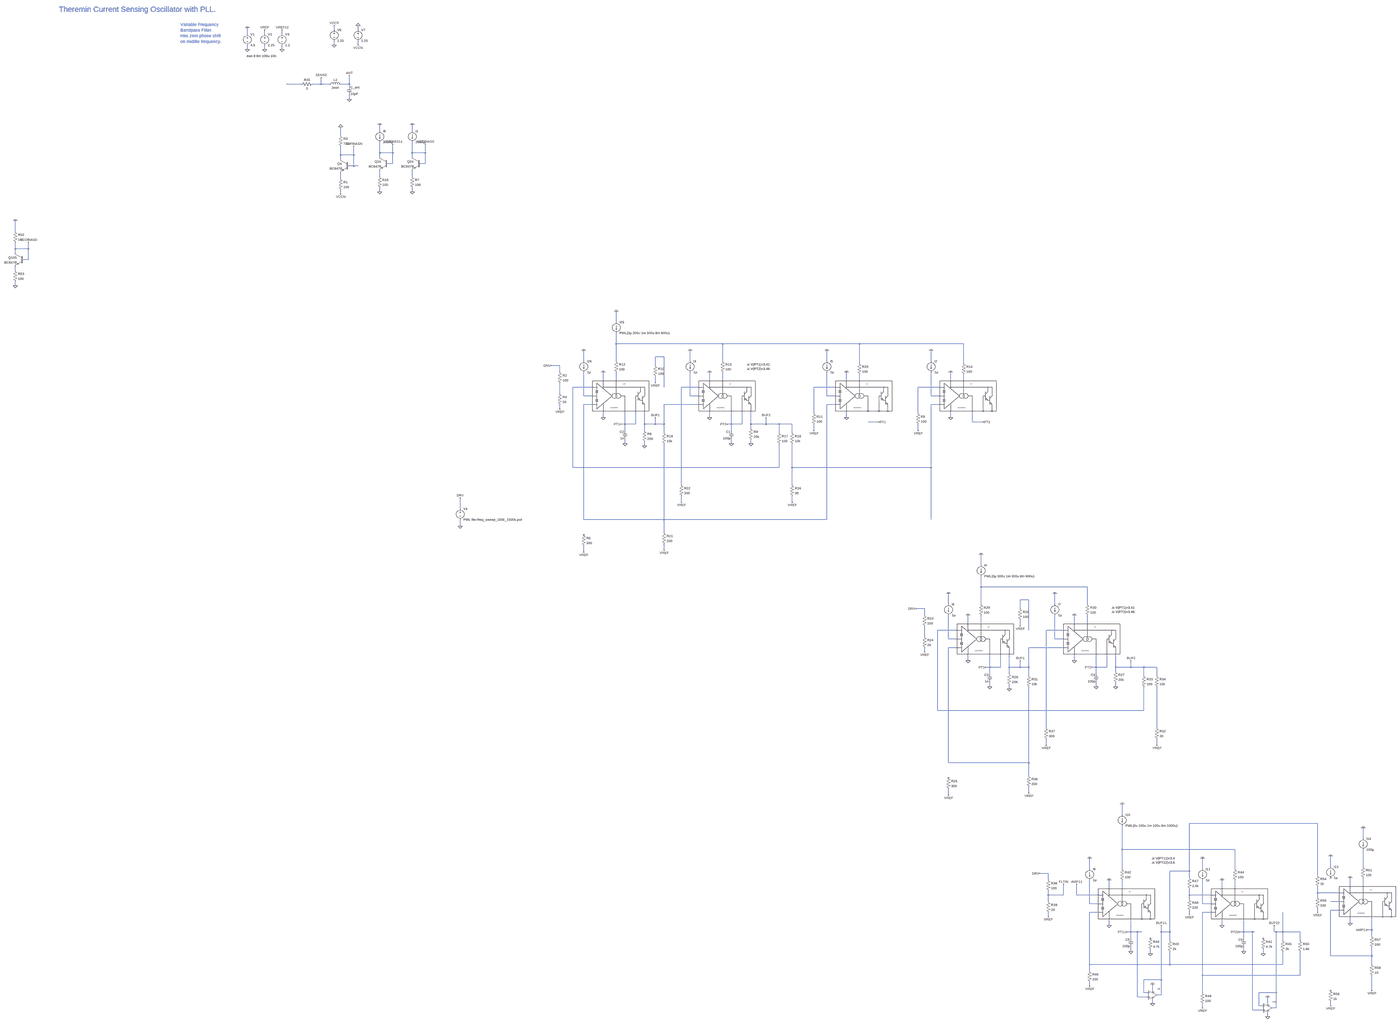
[diagram p0: schematic vco_and_lc_drive_v13.asc, whole sheet]
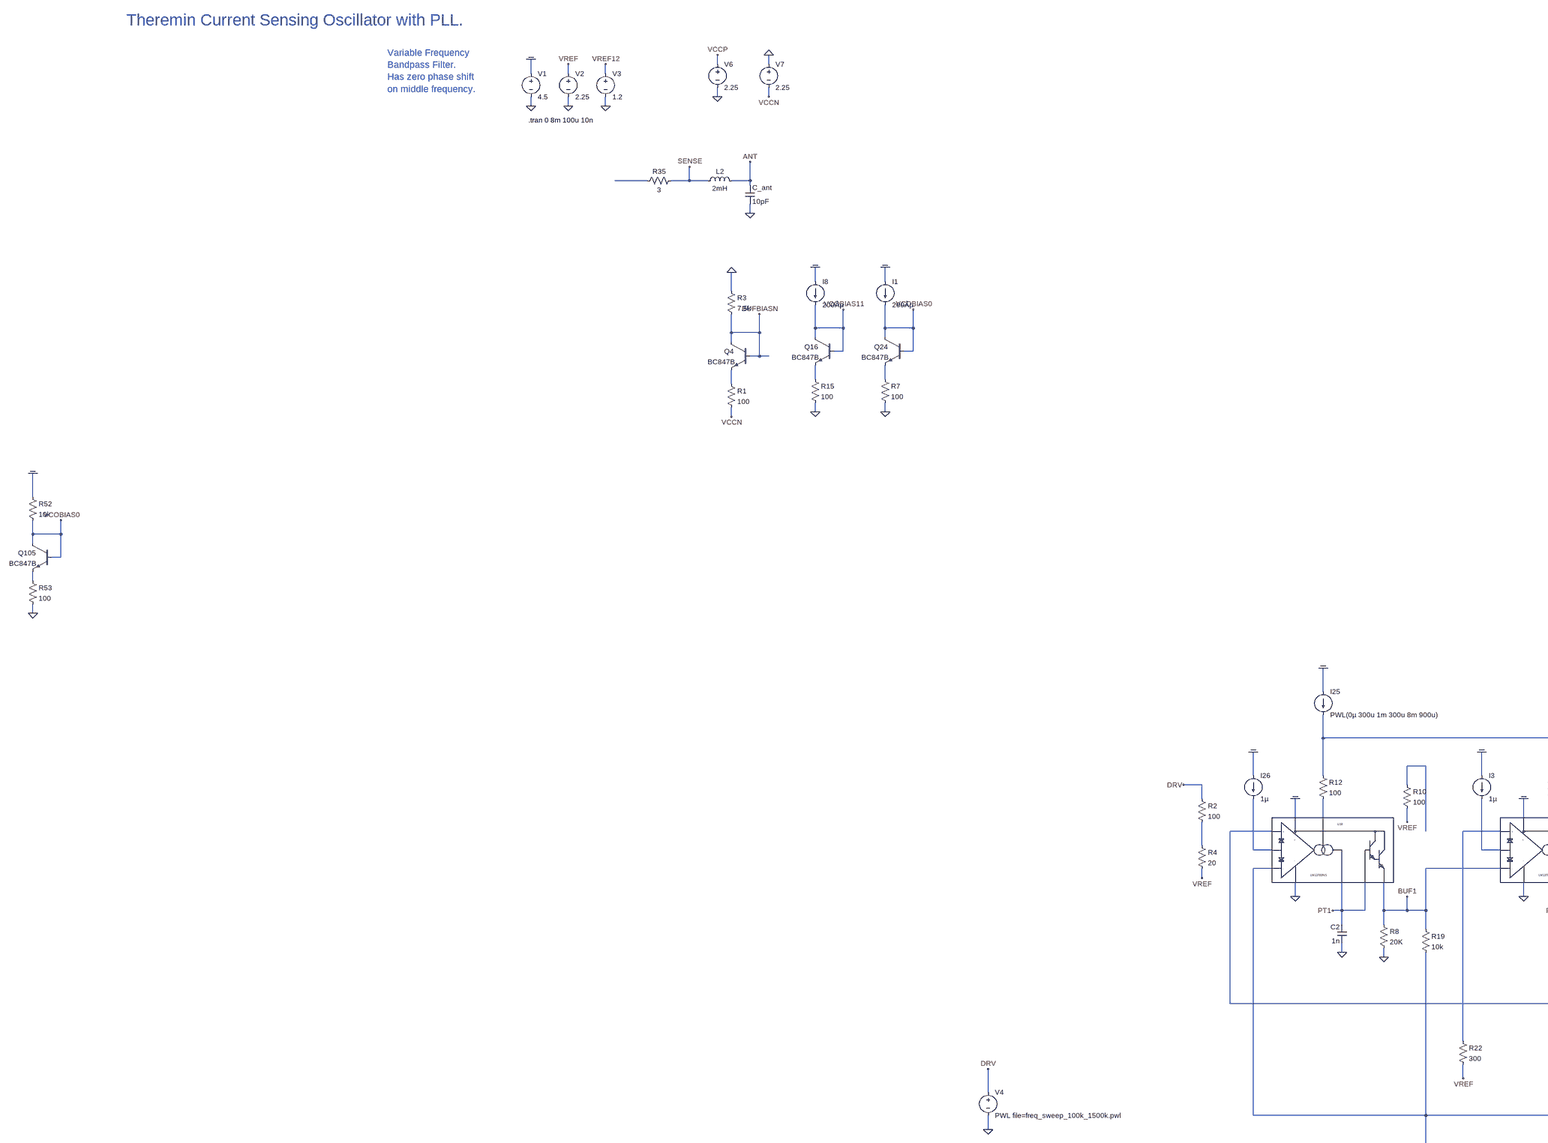
[diagram p1: schematic vco_and_lc_drive_v13.asc, part, row 1 of 2, column 1 of 2]
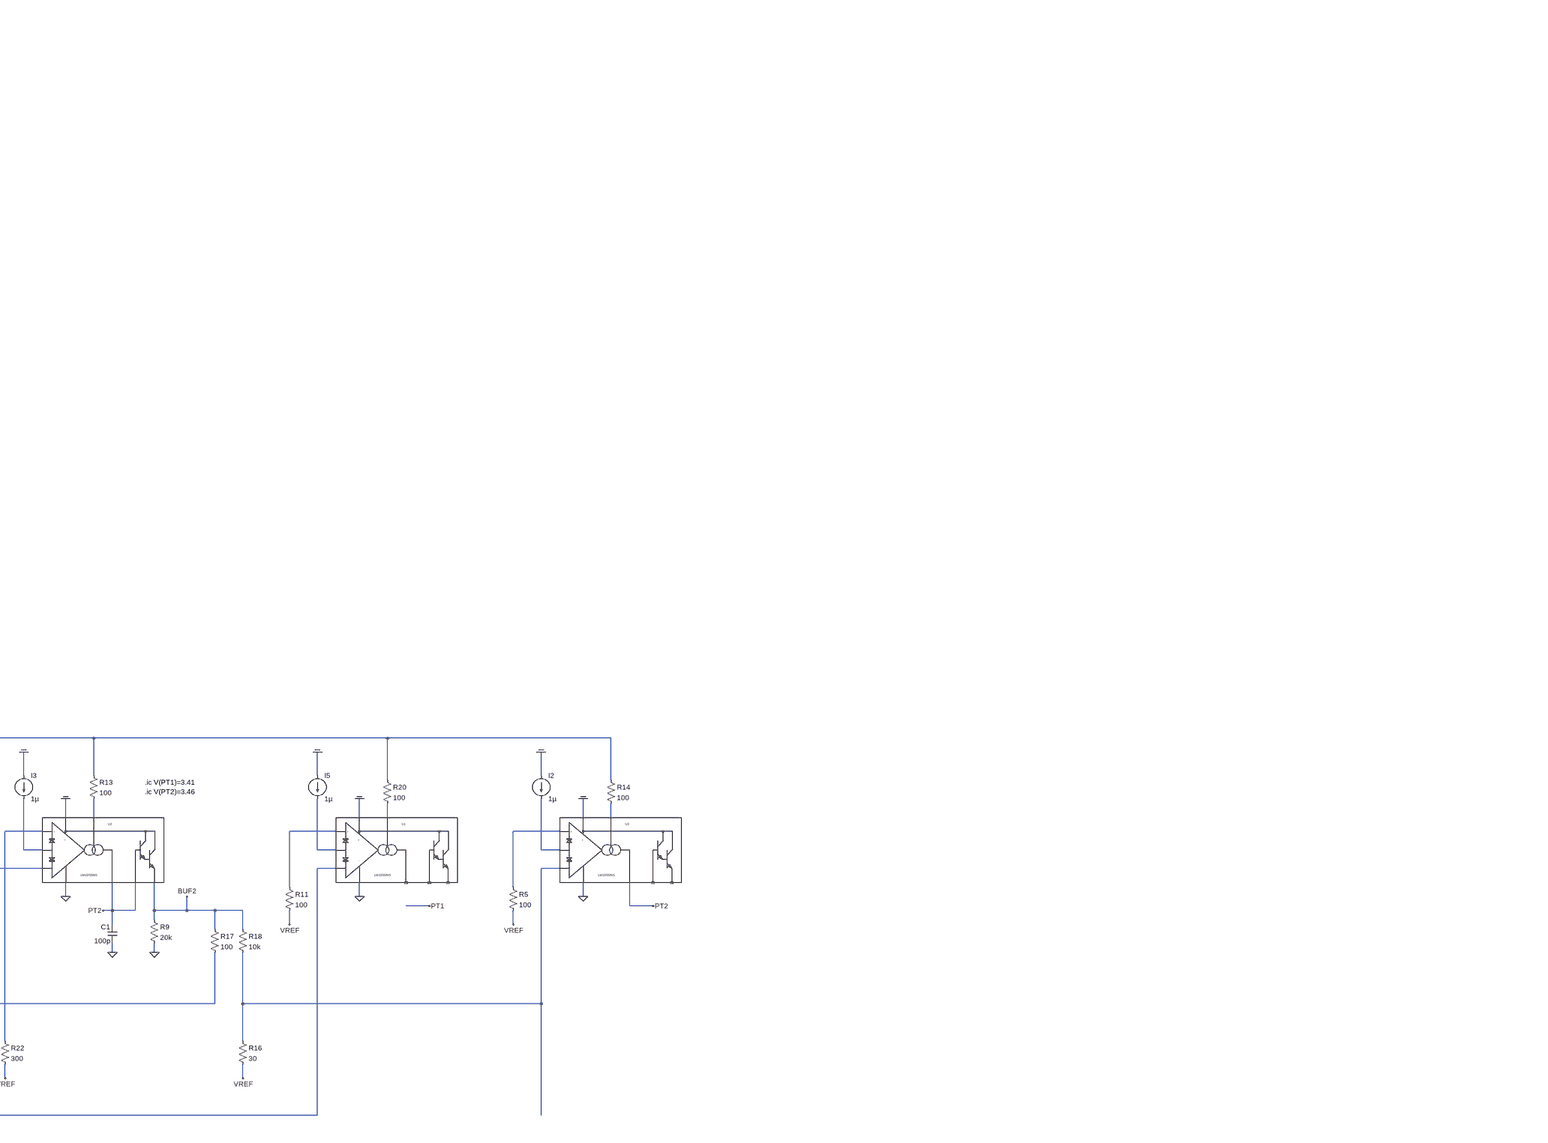
[diagram p2: schematic vco_and_lc_drive_v13.asc, part, row 1 of 2, column 2 of 2]
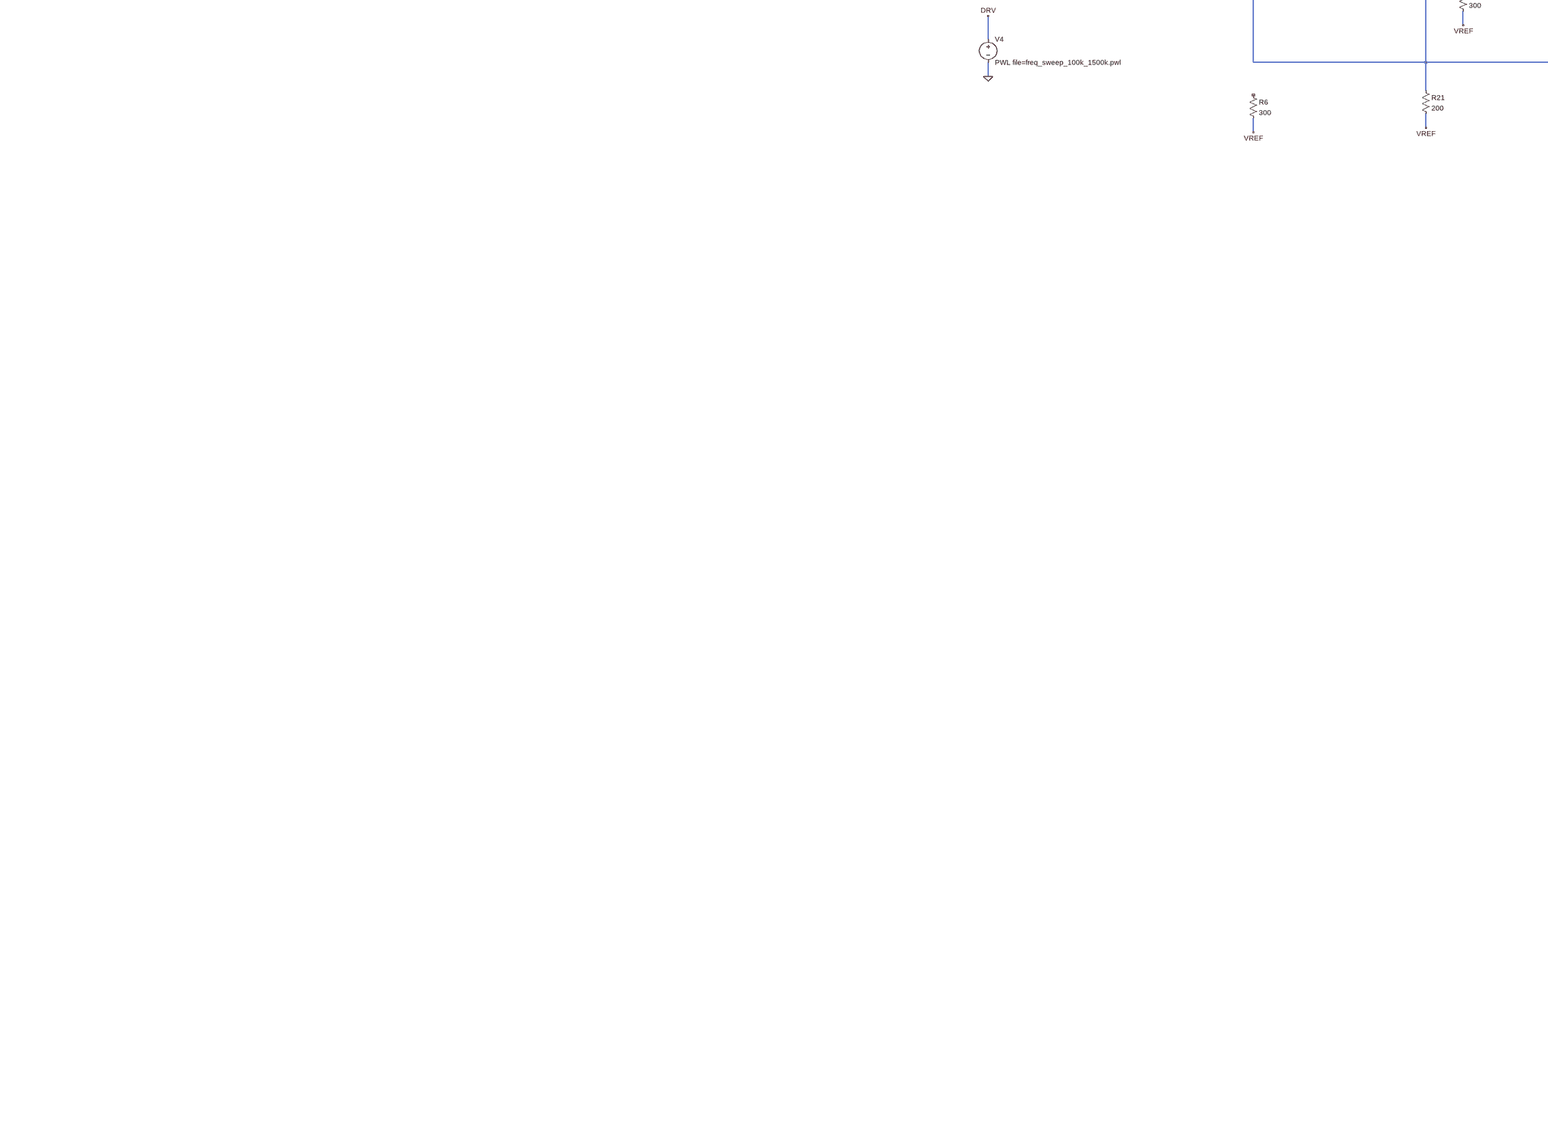
[diagram p3: schematic vco_and_lc_drive_v13.asc, part, row 2 of 2, column 1 of 2]
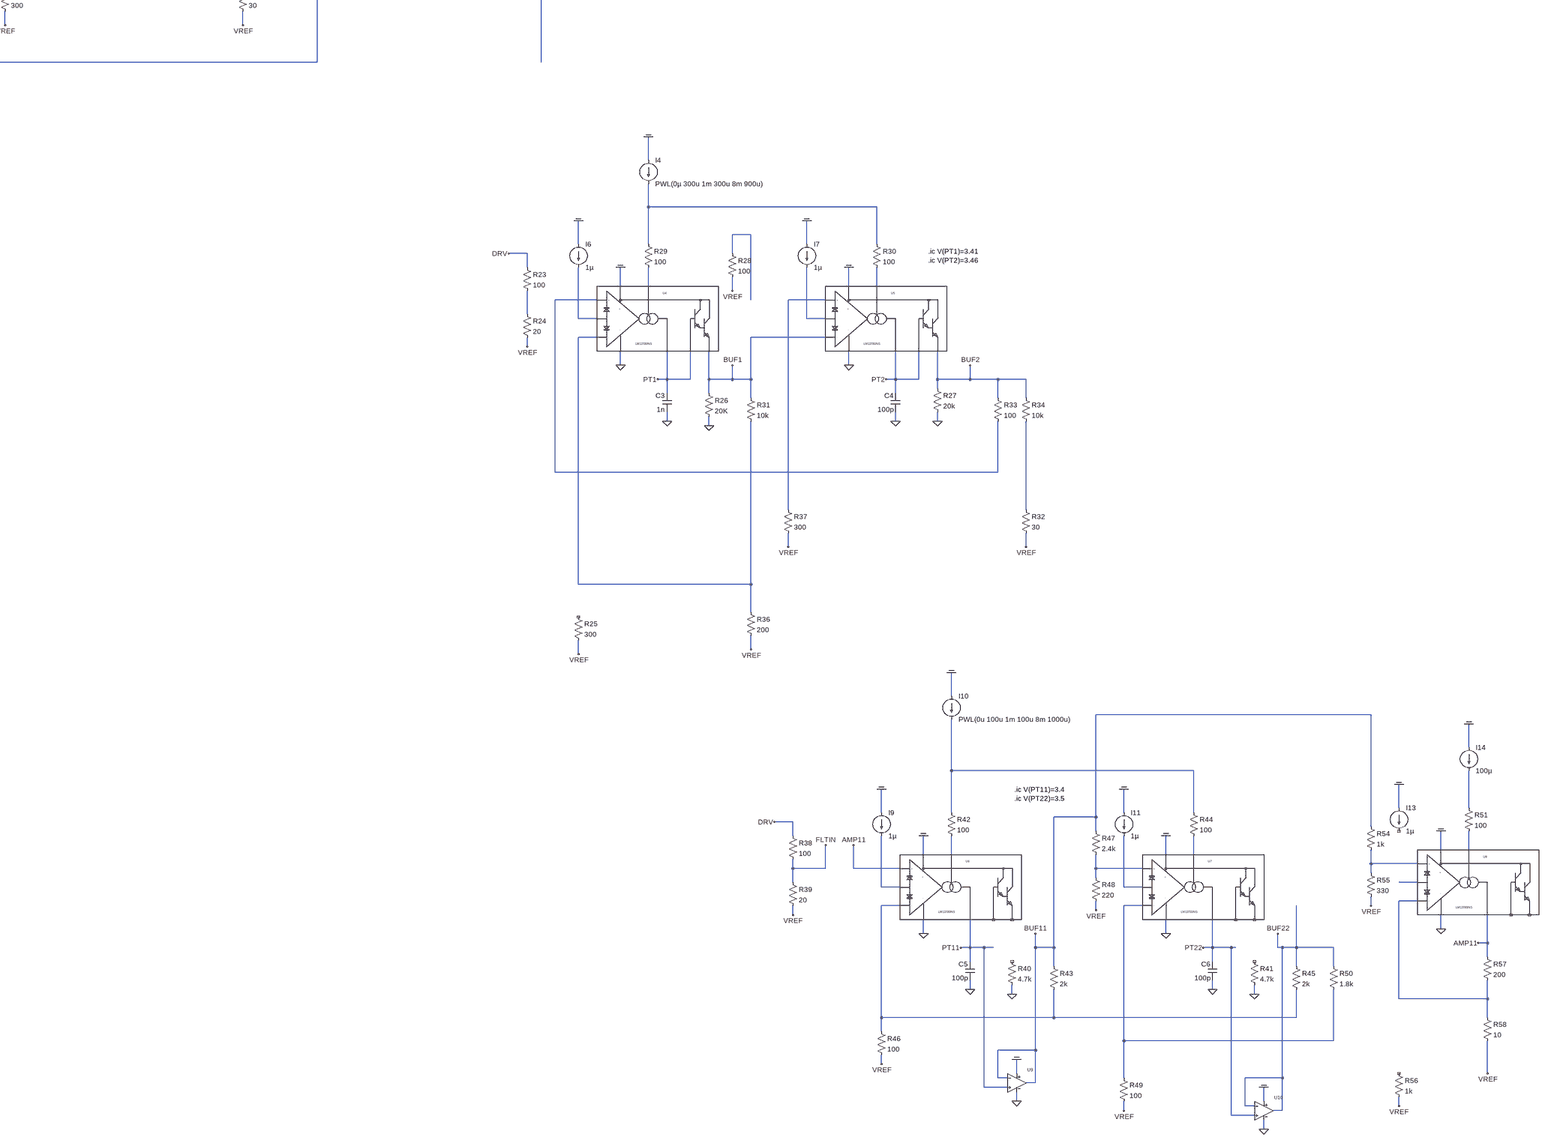
[diagram p4: schematic vco_and_lc_drive_v13.asc, part, row 2 of 2, column 2 of 2]
vco_and_lc_drive_v13.asc, the LTspice schematic file:
Version 4
SHEET 1 13504 27020
WIRE -4960 19040 -4960 19008
WIRE -4784 19040 -4784 19008
WIRE -5600 19072 -5600 19024
WIRE -5472 19072 -5472 19040
WIRE -5344 19072 -5344 19040
WIRE -4960 19152 -4960 19120
WIRE -4784 19152 -4784 19120
WIRE -5600 19184 -5600 19152
WIRE -5472 19184 -5472 19152
WIRE -5344 19184 -5344 19152
WIRE -5200 19440 -5312 19440
WIRE -5056 19440 -5056 19392
WIRE -5056 19440 -5120 19440
WIRE -4992 19440 -5056 19440
WIRE -4848 19440 -4848 19376
WIRE -4848 19440 -4912 19440
WIRE -4848 19456 -4848 19440
WIRE -4848 19552 -4848 19520
WIRE -4624 19856 -4624 19808
WIRE -4384 19856 -4384 19808
WIRE -4912 19888 -4912 19824
WIRE -4624 20016 -4624 19936
WIRE -4528 20016 -4528 19952
WIRE -4528 20016 -4624 20016
WIRE -4384 20016 -4384 19936
WIRE -4288 20016 -4288 19952
WIRE -4288 20016 -4384 20016
WIRE -4912 20032 -4912 19968
WIRE -4816 20032 -4816 19968
WIRE -4816 20032 -4912 20032
WIRE -4624 20048 -4624 20016
WIRE -4384 20048 -4384 20016
WIRE -4912 20064 -4912 20032
WIRE -4528 20096 -4528 20016
WIRE -4528 20096 -4560 20096
WIRE -4288 20096 -4288 20016
WIRE -4288 20096 -4320 20096
WIRE -4816 20112 -4816 20032
WIRE -4816 20112 -4848 20112
WIRE -4784 20112 -4816 20112
WIRE -4624 20192 -4624 20144
WIRE -4384 20192 -4384 20144
WIRE -4912 20208 -4912 20160
WIRE -4624 20304 -4624 20272
WIRE -4384 20304 -4384 20272
WIRE -4912 20320 -4912 20288
WIRE -7904 20928 -7904 20848
WIRE -7904 21056 -7904 21008
WIRE -7808 21056 -7808 21008
WIRE -7808 21056 -7904 21056
WIRE -7904 21088 -7904 21056
WIRE -7808 21136 -7808 21056
WIRE -7808 21136 -7840 21136
WIRE -7904 21216 -7904 21184
WIRE -7904 21328 -7904 21296
WIRE -896 21872 -896 21792
WIRE -896 22032 -896 21952
WIRE -112 22032 -896 22032
WIRE 896 22032 -112 22032
WIRE 1664 22032 896 22032
WIRE -544 22128 -608 22128
WIRE -1136 22160 -1136 22080
WIRE -896 22160 -896 22032
WIRE -352 22160 -352 22080
WIRE -112 22160 -112 22032
WIRE 656 22160 656 22080
WIRE 1424 22160 1424 22080
WIRE 896 22176 896 22032
WIRE 1664 22176 1664 22032
WIRE -1312 22192 -1376 22192
WIRE -608 22192 -608 22128
WIRE -1312 22240 -1312 22192
WIRE -992 22304 -992 22240
WIRE -896 22304 -896 22240
WIRE -208 22304 -208 22240
WIRE -112 22304 -112 22240
WIRE 800 22304 800 22240
WIRE 896 22304 896 22256
WIRE 1568 22304 1568 22240
WIRE 1664 22304 1664 22256
WIRE -608 22320 -608 22272
WIRE -1072 22352 -1216 22352
WIRE -544 22352 -544 22128
WIRE -288 22352 -416 22352
WIRE 720 22352 560 22352
WIRE 1488 22352 1328 22352
WIRE -1312 22400 -1312 22320
WIRE -1136 22416 -1136 22240
WIRE -1072 22416 -1136 22416
WIRE -352 22416 -352 22240
WIRE -288 22416 -352 22416
WIRE 656 22416 656 22240
WIRE 720 22416 656 22416
WIRE 1424 22416 1424 22240
WIRE 1488 22416 1424 22416
WIRE -1072 22480 -1136 22480
WIRE -288 22480 -544 22480
WIRE 720 22480 656 22480
WIRE 1488 22480 1424 22480
WIRE -1312 22512 -1312 22480
WIRE 560 22544 560 22352
WIRE 1328 22544 1328 22352
WIRE -992 22576 -992 22528
WIRE -208 22576 -208 22528
WIRE 800 22576 800 22528
WIRE 1568 22576 1568 22528
WIRE 1040 22608 960 22608
WIRE 1728 22608 1728 22528
WIRE 1808 22608 1728 22608
WIRE -832 22624 -832 22528
WIRE -832 22624 -864 22624
WIRE -752 22624 -752 22528
WIRE -752 22624 -832 22624
WIRE -688 22624 -688 22528
WIRE -608 22624 -608 22576
WIRE -608 22624 -688 22624
WIRE -544 22624 -544 22480
WIRE -544 22624 -608 22624
WIRE -48 22624 -48 22528
WIRE -48 22624 -80 22624
WIRE 32 22624 32 22528
WIRE 32 22624 -48 22624
WIRE 96 22624 96 22528
WIRE 208 22624 208 22576
WIRE 208 22624 96 22624
WIRE 304 22624 208 22624
WIRE 400 22624 304 22624
WIRE 96 22656 96 22624
WIRE -832 22672 -832 22624
WIRE -688 22672 -688 22624
WIRE -48 22672 -48 22624
WIRE 560 22672 560 22624
WIRE 1328 22672 1328 22624
WIRE -544 22688 -544 22624
WIRE 304 22688 304 22624
WIRE 400 22688 400 22624
WIRE -832 22768 -832 22736
WIRE -48 22768 -48 22736
WIRE 96 22768 96 22736
WIRE -688 22784 -688 22752
WIRE -1216 22944 -1216 22352
WIRE 304 22944 304 22768
WIRE 304 22944 -1216 22944
WIRE 400 22944 400 22768
WIRE 1424 22944 1424 22480
WIRE 1424 22944 400 22944
WIRE -416 23072 -416 22352
WIRE 400 23072 400 22944
WIRE -416 23200 -416 23152
WIRE 400 23200 400 23152
WIRE -2224 23248 -2224 23168
WIRE -1136 23328 -1136 22480
WIRE -544 23328 -544 22768
WIRE -544 23328 -1136 23328
WIRE 656 23328 656 22480
WIRE 656 23328 -544 23328
WIRE 1424 23328 1424 22944
WIRE -2224 23376 -2224 23328
WIRE -544 23424 -544 23328
WIRE -544 23552 -544 23504
WIRE -1136 23568 -1136 23520
WIRE 1792 23664 1792 23584
WIRE 1792 23824 1792 23744
WIRE 2576 23824 1792 23824
WIRE 2144 23920 2080 23920
WIRE 1552 23952 1552 23872
WIRE 1792 23952 1792 23824
WIRE 2336 23952 2336 23872
WIRE 2576 23952 2576 23824
WIRE 1376 23984 1312 23984
WIRE 2080 23984 2080 23920
WIRE 1376 24032 1376 23984
WIRE 1696 24096 1696 24032
WIRE 1792 24096 1792 24032
WIRE 2480 24096 2480 24032
WIRE 2576 24096 2576 24032
WIRE 2080 24112 2080 24064
WIRE 1616 24144 1472 24144
WIRE 2144 24144 2144 23920
WIRE 2400 24144 2272 24144
WIRE 1376 24192 1376 24112
WIRE 1552 24208 1552 24032
WIRE 1616 24208 1552 24208
WIRE 2336 24208 2336 24032
WIRE 2400 24208 2336 24208
WIRE 1616 24272 1552 24272
WIRE 2400 24272 2144 24272
WIRE 1376 24304 1376 24272
WIRE 1696 24368 1696 24320
WIRE 2480 24368 2480 24320
WIRE 1856 24416 1856 24320
WIRE 1856 24416 1824 24416
WIRE 1936 24416 1936 24320
WIRE 1936 24416 1856 24416
WIRE 2000 24416 2000 24320
WIRE 2080 24416 2080 24368
WIRE 2080 24416 2000 24416
WIRE 2144 24416 2144 24272
WIRE 2144 24416 2080 24416
WIRE 2640 24416 2640 24320
WIRE 2640 24416 2608 24416
WIRE 2720 24416 2720 24320
WIRE 2720 24416 2640 24416
WIRE 2784 24416 2784 24320
WIRE 2896 24416 2896 24368
WIRE 2896 24416 2784 24416
WIRE 2992 24416 2896 24416
WIRE 3088 24416 2992 24416
WIRE 2784 24448 2784 24416
WIRE 1856 24464 1856 24416
WIRE 2000 24464 2000 24416
WIRE 2640 24464 2640 24416
WIRE 2144 24480 2144 24416
WIRE 2992 24480 2992 24416
WIRE 3088 24480 3088 24416
WIRE 1856 24560 1856 24528
WIRE 2640 24560 2640 24528
WIRE 2784 24560 2784 24528
WIRE 2000 24576 2000 24544
WIRE 1472 24736 1472 24144
WIRE 2992 24736 2992 24560
WIRE 2992 24736 1472 24736
WIRE 2272 24864 2272 24144
WIRE 3088 24864 3088 24560
WIRE 2272 24992 2272 24944
WIRE 3088 24992 3088 24944
WIRE 1552 25120 1552 24272
WIRE 2144 25120 2144 24560
WIRE 2144 25120 1552 25120
WIRE 2144 25216 2144 25120
WIRE 2144 25344 2144 25296
WIRE 1552 25360 1552 25312
WIRE 2832 25504 2832 25424
WIRE 4272 25568 3328 25568
WIRE 4608 25680 4608 25600
WIRE 2832 25760 2832 25584
WIRE 3664 25760 2832 25760
WIRE 4368 25888 4368 25808
WIRE 4608 25888 4608 25760
WIRE 2592 25904 2592 25824
WIRE 2832 25904 2832 25760
WIRE 3424 25904 3424 25824
WIRE 3664 25904 3664 25760
WIRE 3328 25920 3328 25568
WIRE 3328 25920 3184 25920
WIRE 2288 25936 2224 25936
WIRE 4272 25952 4272 25568
WIRE 3328 25968 3328 25920
WIRE 2288 25984 2288 25936
WIRE 4512 26032 4512 25968
WIRE 4608 26032 4608 25968
WIRE 2736 26048 2736 25984
WIRE 2832 26048 2832 25984
WIRE 3568 26048 3568 25984
WIRE 3664 26048 3664 25984
WIRE 4272 26080 4272 26032
WIRE 4432 26080 4272 26080
WIRE 2288 26096 2288 26064
WIRE 2400 26096 2400 26016
WIRE 2400 26096 2288 26096
WIRE 2496 26096 2496 26016
WIRE 2656 26096 2496 26096
WIRE 3328 26096 3328 26048
WIRE 3488 26096 3328 26096
WIRE 4272 26112 4272 26080
WIRE 3328 26128 3328 26096
WIRE 2288 26144 2288 26096
WIRE 4432 26144 4368 26144
WIRE 2592 26160 2592 25984
WIRE 2656 26160 2592 26160
WIRE 3424 26160 3424 25984
WIRE 3488 26160 3424 26160
WIRE 4432 26208 4368 26208
WIRE 2656 26224 2592 26224
WIRE 3488 26224 3424 26224
WIRE 4272 26224 4272 26192
WIRE 3328 26240 3328 26208
WIRE 2288 26256 2288 26224
WIRE 4512 26304 4512 26256
WIRE 2736 26320 2736 26272
WIRE 3568 26320 3568 26272
WIRE 4672 26352 4672 26256
WIRE 4672 26352 4640 26352
WIRE 2896 26368 2896 26272
WIRE 2896 26368 2864 26368
WIRE 2944 26368 2896 26368
WIRE 2976 26368 2944 26368
WIRE 3120 26368 3120 26320
WIRE 3184 26368 3184 25920
WIRE 3184 26368 3120 26368
WIRE 3728 26368 3728 26272
WIRE 3728 26368 3696 26368
WIRE 3792 26368 3728 26368
WIRE 3808 26368 3792 26368
WIRE 3952 26368 3952 26320
WIRE 3968 26368 3952 26368
WIRE 4016 26368 4016 26224
WIRE 4016 26368 3968 26368
WIRE 4144 26368 4016 26368
WIRE 4672 26400 4672 26352
WIRE 2896 26416 2896 26368
WIRE 3728 26416 3728 26368
WIRE 3184 26432 3184 26368
WIRE 4016 26432 4016 26368
WIRE 4144 26432 4144 26368
WIRE 2896 26512 2896 26480
WIRE 3728 26512 3728 26480
WIRE 3040 26528 3040 26496
WIRE 3872 26528 3872 26496
WIRE 4368 26544 4368 26208
WIRE 4672 26544 4672 26480
WIRE 4672 26544 4368 26544
WIRE 2592 26608 2592 26224
WIRE 3184 26608 3184 26512
WIRE 3184 26608 2592 26608
WIRE 4016 26608 4016 26512
WIRE 4016 26608 3184 26608
WIRE 4672 26608 4672 26544
WIRE 2592 26656 2592 26608
WIRE 3424 26688 3424 26224
WIRE 4144 26688 4144 26512
WIRE 4144 26688 3424 26688
WIRE 3120 26720 3120 26368
WIRE 3120 26720 2992 26720
WIRE 2592 26768 2592 26736
WIRE 3056 26800 3056 26752
WIRE 4672 26800 4672 26688
WIRE 2992 26816 2992 26720
WIRE 3024 26816 2992 26816
WIRE 3424 26816 3424 26688
WIRE 3968 26816 3968 26368
WIRE 3968 26816 3840 26816
WIRE 3120 26832 3120 26720
WIRE 3120 26832 3088 26832
WIRE 2944 26848 2944 26368
WIRE 3024 26848 2944 26848
WIRE 3056 26896 3056 26864
WIRE 3904 26896 3904 26848
WIRE 3840 26912 3840 26816
WIRE 3872 26912 3840 26912
WIRE 4368 26912 4368 26880
WIRE 3424 26928 3424 26896
WIRE 3968 26928 3968 26816
WIRE 3968 26928 3936 26928
WIRE 3792 26944 3792 26368
WIRE 3872 26944 3792 26944
WIRE 3904 26992 3904 26960
FLAG -5600 19184 0
FLAG -5600 19024 COM
FLAG -5472 19184 0
FLAG -5472 19040 VREF
FLAG -4848 19376 ANT
FLAG -5056 19392 SENSE
FLAG -5344 19184 0
FLAG -5344 19040 VREF12
FLAG -7904 20848 COM
FLAG -7904 21328 0
FLAG -7808 21008 VCOBIAS0
FLAG -4960 19152 0
FLAG -4960 19008 VCCP
FLAG -4784 19008 0
FLAG -4784 19152 VCCN
FLAG -4912 20320 VCCN
FLAG -4912 19824 0
FLAG -4816 19968 BUFBIASN
FLAG -4848 19552 0
FLAG -4624 20304 0
FLAG -4528 19952 VCOBIAS11
FLAG -4624 19808 COM
FLAG -4384 20304 0
FLAG -4288 19952 VCOBIAS0
FLAG -4384 19808 COM
FLAG -2224 23376 0
FLAG -2224 23168 DRV
FLAG -1376 22192 DRV
FLAG -992 22576 0
FLAG -992 22240 COM
FLAG -896 21792 COM
FLAG -1136 22080 COM
FLAG -832 22768 0
FLAG -864 22624 PT1
FLAG -208 22576 0
FLAG -208 22240 COM
FLAG -352 22080 COM
FLAG -48 22768 0
FLAG -80 22624 PT2
FLAG -1312 22512 VREF
FLAG 800 22576 0
FLAG 800 22240 COM
FLAG 656 22080 COM
FLAG -1136 23568 VREF
FLAG -688 22784 0
FLAG 96 22768 0
FLAG -608 22320 VREF
FLAG 208 22576 BUF2
FLAG -608 22576 BUF1
FLAG 560 22672 VREF
FLAG 400 23200 VREF
FLAG -544 23552 VREF
FLAG 1040 22608 PT1
FLAG 1568 22576 0
FLAG 1568 22240 COM
FLAG 1424 22080 COM
FLAG 1328 22672 VREF
FLAG 1808 22608 PT2
FLAG -416 23200 VREF
FLAG 1312 23984 DRV
FLAG 1696 24368 0
FLAG 1696 24032 COM
FLAG 1792 23584 COM
FLAG 1552 23872 COM
FLAG 1856 24560 0
FLAG 1824 24416 PT1
FLAG 2480 24368 0
FLAG 2480 24032 COM
FLAG 2336 23872 COM
FLAG 2640 24560 0
FLAG 2608 24416 PT2
FLAG 1376 24304 VREF
FLAG 1552 25360 VREF
FLAG 2000 24576 0
FLAG 2784 24560 0
FLAG 2080 24112 VREF
FLAG 2896 24368 BUF2
FLAG 2080 24368 BUF1
FLAG 3088 24992 VREF
FLAG 2144 25344 VREF
FLAG 2272 24992 VREF
FLAG 2224 25936 DRV
FLAG 2736 26320 0
FLAG 2736 25984 COM
FLAG 2592 25824 COM
FLAG 2896 26512 0
FLAG 2864 26368 PT11
FLAG 2288 26256 VREF
FLAG 3040 26528 0
FLAG 3120 26320 BUF11
FLAG 2832 25424 COM
FLAG 3568 26320 0
FLAG 3568 25984 COM
FLAG 3424 25824 COM
FLAG 3728 26512 0
FLAG 3696 26368 PT22
FLAG 3872 26528 0
FLAG 3952 26320 BUF22
FLAG 2592 26768 VREF
FLAG 3328 26240 VREF
FLAG 3424 26928 VREF
FLAG 4512 26304 0
FLAG 4512 25968 COM
FLAG 4368 25808 COM
FLAG 4640 26352 AMP11
FLAG 4608 25600 COM
FLAG 4272 26224 VREF
FLAG 4368 26912 VREF
FLAG 4672 26800 VREF
FLAG 2400 26016 FLTIN
FLAG 2496 26016 AMP11
FLAG 3056 26896 0
FLAG 3056 26752 COM
FLAG 3904 26992 0
FLAG 3904 26848 COM
SYMBOL voltage -5600 19056 R0
SYMATTR InstName V1
SYMATTR Value 4.5
SYMBOL Voltage -5472 19056 R0
SYMATTR InstName V2
SYMATTR Value 2.25
SYMBOL ind -5008 19456 R270
WINDOW 0 32 56 VTop 2
WINDOW 3 5 56 VBottom 2
SYMATTR InstName L2
SYMATTR Value 2mH
SYMATTR SpiceLine Rser=120 Cpar=1pF
SYMBOL Cap -4864 19456 R0
SYMATTR InstName C_ant
SYMATTR Value 10pF
SYMBOL Res -5216 19456 R270
WINDOW 0 32 56 VTop 2
WINDOW 3 0 56 VBottom 2
SYMATTR InstName R35
SYMATTR Value 3
SYMBOL Voltage -5344 19056 R0
SYMATTR InstName V3
SYMATTR Value 1.2
SYMBOL npn -7840 21088 M0
SYMATTR InstName Q105
SYMATTR Value BC847B
SYMBOL Res -7920 20912 R0
SYMATTR InstName R52
SYMATTR Value 10k
SYMBOL Res -7920 21200 R0
SYMATTR InstName R53
SYMATTR Value 100
SYMBOL Voltage -4960 19024 R0
SYMATTR InstName V6
SYMATTR Value 2.25
SYMBOL Voltage -4784 19024 R0
SYMATTR InstName V7
SYMATTR Value 2.25
SYMBOL npn -4848 20064 M0
SYMATTR InstName Q4
SYMATTR Value BC847B
SYMBOL Res -4928 20192 R0
SYMATTR InstName R1
SYMATTR Value 100
SYMBOL Res -4928 19872 R0
SYMATTR InstName R3
SYMATTR Value 7.5k
SYMBOL npn -4560 20048 M0
SYMATTR InstName Q16
SYMATTR Value BC847B
SYMBOL Res -4640 20176 R0
SYMATTR InstName R15
SYMATTR Value 100
SYMBOL current -4624 19856 R0
SYMATTR InstName I8
SYMATTR Value 200Âµ
SYMBOL npn -4320 20048 M0
SYMATTR InstName Q24
SYMATTR Value BC847B
SYMBOL Res -4400 20176 R0
SYMATTR InstName R7
SYMATTR Value 100
SYMBOL current -4384 19856 R0
SYMATTR InstName I1
SYMATTR Value 200Âµ
SYMBOL Voltage -2224 23232 R0
SYMATTR InstName V4
SYMATTR Value PWL file=freq_sweep_100k_1500k.pwl
SYMBOL LM13700 -992 22416 R0
SYMATTR InstName U18
SYMBOL current -896 21872 R0
SYMATTR InstName I25
SYMATTR Value PWL(0µ 300u 1m 300u 8m 900u)
SYMBOL current -1136 22160 R0
SYMATTR InstName I26
SYMATTR Value 1µ
SYMBOL Cap -816 22736 R180
WINDOW 0 24 56 Left 2
WINDOW 3 24 8 Left 2
SYMATTR InstName C2
SYMATTR Value 1n
SYMBOL LM13700 -208 22416 R0
SYMATTR InstName U2
SYMBOL current -352 22160 R0
SYMATTR InstName I3
SYMATTR Value 1µ
SYMBOL Cap -32 22736 R180
WINDOW 0 24 56 Left 2
WINDOW 3 24 8 Left 2
SYMATTR InstName C1
SYMATTR Value 100p
SYMBOL Res -1328 22224 R0
SYMATTR InstName R2
SYMATTR Value 100
SYMBOL Res -1328 22384 R0
SYMATTR InstName R4
SYMATTR Value 20
SYMBOL LM13700 800 22416 R0
SYMATTR InstName U1
SYMBOL current 656 22160 R0
SYMATTR InstName I5
SYMATTR Value 1µ
SYMBOL Res -1152 23424 R0
SYMATTR InstName R6
SYMATTR Value 300
SYMBOL Res -704 22656 R0
SYMATTR InstName R8
SYMATTR Value 20K
SYMBOL Res 80 22640 R0
SYMATTR InstName R9
SYMATTR Value 20k
SYMBOL Res -624 22176 R0
SYMATTR InstName R10
SYMATTR Value 100
SYMBOL Res 544 22528 R0
SYMATTR InstName R11
SYMATTR Value 100
SYMBOL Res -912 22144 R0
SYMATTR InstName R12
SYMATTR Value 100
SYMBOL Res -128 22144 R0
SYMATTR InstName R13
SYMATTR Value 100
SYMBOL Res -560 22672 R0
SYMATTR InstName R19
SYMATTR Value 10k
SYMBOL Res 384 23056 R0
SYMATTR InstName R16
SYMATTR Value 30
SYMBOL Res 288 22672 R0
SYMATTR InstName R17
SYMATTR Value 100
SYMBOL Res 384 22672 R0
SYMATTR InstName R18
SYMATTR Value 10k
SYMBOL Res 880 22160 R0
SYMATTR InstName R20
SYMATTR Value 100
SYMBOL Res -560 23408 R0
SYMATTR InstName R21
SYMATTR Value 200
SYMBOL LM13700 1568 22416 R0
SYMATTR InstName U3
SYMBOL current 1424 22160 R0
SYMATTR InstName I2
SYMATTR Value 1µ
SYMBOL Res 1312 22528 R0
SYMATTR InstName R5
SYMATTR Value 100
SYMBOL Res 1648 22160 R0
SYMATTR InstName R14
SYMATTR Value 100
SYMBOL Res -432 23056 R0
SYMATTR InstName R22
SYMATTR Value 300
SYMBOL LM13700 1696 24208 R0
SYMATTR InstName U4
SYMBOL current 1792 23664 R0
SYMATTR InstName I4
SYMATTR Value PWL(0µ 300u 1m 300u 8m 900u)
SYMBOL current 1552 23952 R0
SYMATTR InstName I6
SYMATTR Value 1µ
SYMBOL Cap 1872 24528 R180
WINDOW 0 24 56 Left 2
WINDOW 3 24 8 Left 2
SYMATTR InstName C3
SYMATTR Value 1n
SYMBOL LM13700 2480 24208 R0
SYMATTR InstName U5
SYMBOL current 2336 23952 R0
SYMATTR InstName I7
SYMATTR Value 1µ
SYMBOL Cap 2656 24528 R180
WINDOW 0 24 56 Left 2
WINDOW 3 24 8 Left 2
SYMATTR InstName C4
SYMATTR Value 100p
SYMBOL Res 1360 24016 R0
SYMATTR InstName R23
SYMATTR Value 100
SYMBOL Res 1360 24176 R0
SYMATTR InstName R24
SYMATTR Value 20
SYMBOL Res 1536 25216 R0
SYMATTR InstName R25
SYMATTR Value 300
SYMBOL Res 1984 24448 R0
SYMATTR InstName R26
SYMATTR Value 20K
SYMBOL Res 2768 24432 R0
SYMATTR InstName R27
SYMATTR Value 20k
SYMBOL Res 2064 23968 R0
SYMATTR InstName R28
SYMATTR Value 100
SYMBOL Res 1776 23936 R0
SYMATTR InstName R29
SYMATTR Value 100
SYMBOL Res 2560 23936 R0
SYMATTR InstName R30
SYMATTR Value 100
SYMBOL Res 2128 24464 R0
SYMATTR InstName R31
SYMATTR Value 10k
SYMBOL Res 3072 24848 R0
SYMATTR InstName R32
SYMATTR Value 30
SYMBOL Res 2976 24464 R0
SYMATTR InstName R33
SYMATTR Value 100
SYMBOL Res 3072 24464 R0
SYMATTR InstName R34
SYMATTR Value 10k
SYMBOL Res 2128 25200 R0
SYMATTR InstName R36
SYMATTR Value 200
SYMBOL Res 2256 24848 R0
SYMATTR InstName R37
SYMATTR Value 300
SYMBOL LM13700 2736 26160 R0
SYMATTR InstName U6
SYMBOL current 2592 25904 R0
SYMATTR InstName I9
SYMATTR Value 1µ
SYMBOL Cap 2912 26480 R180
WINDOW 0 24 56 Left 2
WINDOW 3 24 8 Left 2
SYMATTR InstName C5
SYMATTR Value 100p
SYMBOL Res 2272 25968 R0
SYMATTR InstName R38
SYMATTR Value 100
SYMBOL Res 2272 26128 R0
SYMATTR InstName R39
SYMATTR Value 20
SYMBOL Res 3024 26400 R0
SYMATTR InstName R40
SYMATTR Value 4.7k
SYMBOL Res 2816 25888 R0
SYMATTR InstName R42
SYMATTR Value 100
SYMBOL Res 3168 26416 R0
SYMATTR InstName R43
SYMATTR Value 2k
SYMBOL current 2832 25504 R0
SYMATTR InstName I10
SYMATTR Value PWL(0u 100u 1m 100u 8m 1000u)
SYMBOL LM13700 3568 26160 R0
SYMATTR InstName U7
SYMBOL current 3424 25904 R0
SYMATTR InstName I11
SYMATTR Value 1µ
SYMBOL Cap 3744 26480 R180
WINDOW 0 24 56 Left 2
WINDOW 3 24 8 Left 2
SYMATTR InstName C6
SYMATTR Value 100p
SYMBOL Res 3856 26400 R0
SYMATTR InstName R41
SYMATTR Value 4.7k
SYMBOL Res 3648 25888 R0
SYMATTR InstName R44
SYMATTR Value 100
SYMBOL Res 4000 26416 R0
SYMATTR InstName R45
SYMATTR Value 2k
SYMBOL Res 2576 26640 R0
SYMATTR InstName R46
SYMATTR Value 100
SYMBOL Res 3312 25952 R0
SYMATTR InstName R47
SYMATTR Value 2.4k
SYMBOL Res 3312 26112 R0
SYMATTR InstName R48
SYMATTR Value 220
SYMBOL Res 3408 26800 R0
SYMATTR InstName R49
SYMATTR Value 100
SYMBOL LM13700 4512 26144 R0
SYMATTR InstName U8
SYMBOL current 4368 25888 R0
SYMATTR InstName I13
SYMATTR Value 1µ
SYMBOL Res 4592 25872 R0
SYMATTR InstName R51
SYMATTR Value 100
SYMBOL current 4608 25680 R0
SYMATTR InstName I14
SYMATTR Value 100µ
SYMBOL Res 4256 25936 R0
SYMATTR InstName R54
SYMATTR Value 1k
SYMBOL Res 4256 26096 R0
SYMATTR InstName R55
SYMATTR Value 330
SYMBOL Res 4352 26784 R0
SYMATTR InstName R56
SYMATTR Value 1k
SYMBOL Res 4656 26384 R0
SYMATTR InstName R57
SYMATTR Value 200
SYMBOL Res 4128 26416 R0
SYMATTR InstName R50
SYMATTR Value 1.8k
SYMBOL MCP6021 3056 26832 R0
SYMATTR InstName U9
SYMBOL MCP6021 3904 26928 R0
SYMATTR InstName U10
SYMBOL Res 4656 26592 R0
SYMATTR InstName R58
SYMATTR Value 10
TEXT -5608 19232 Left 2 !.tran 0 8m 100u 10n
TEXT -7336 18888 Left 5 ;Theremin Current Sensing Oscillator with PLL.
TEXT -6440 19000 Left 3 ;Variable Frequency \nBandpass Filter.\nHas zero phase shift \non middle frequency.
TEXT 64 22184 Left 2 !.ic V(PT1)=3.41\n.ic V(PT2)=3.46
TEXT 2752 23976 Left 2 !.ic V(PT1)=3.41\n.ic V(PT2)=3.46
TEXT 3048 25824 Left 2 !.ic V(PT11)=3.4\n.ic V(PT22)=3.5

The netlist it stands for:
* vco_and_lc_drive_v13.asc
V1 COM 0 4.5
V2 VREF 0 2.25
L2 SENSE ANT 2mH Rser=120 Cpar=1pF
C_ant ANT 0 10pF
R35 N001 SENSE 3
V3 VREF12 0 1.2
Q105 VCOBIAS0 VCOBIAS0 N005 0 BC847B
R52 COM VCOBIAS0 10k
R53 N005 0 100
V6 VCCP 0 2.25
V7 0 VCCN 2.25
Q4 BUFBIASN BUFBIASN N004 0 BC847B
R1 N004 VCCN 100
R3 0 BUFBIASN 7.5k
Q16 VCOBIAS11 VCOBIAS11 N002 0 BC847B
R15 N002 0 100
I8 COM VCOBIAS11 200Âµ
Q24 VCOBIAS0 VCOBIAS0 N003 0 BC847B
R7 N003 0 100
I1 COM VCOBIAS0 200Âµ
V4 DRV 0 PWL file=freq_sweep_100k_1500k.pwl
XU18 N008 N017 N012 N021 PT1 0 PT1 BUF1 COM LM13700/NS  ; pins Ibias Dio_bias in+ in- out V- buf_in buf_out V+
I25 COM N006 PWL(0µ 300u 1m 300u 8m 900u)
I26 COM N017 1µ
C2 0 PT1 1n
XU2 N009 N018 N013 BUF1 PT2 0 PT2 BUF2 COM LM13700/NS  ; pins Ibias Dio_bias in+ in- out V- buf_in buf_out V+
I3 COM N018 1µ
C1 0 PT2 100p
R2 DRV N016 100
R4 N016 VREF 20
XU1 N010 N019 N014 N021 NC_01 0 NC_02 NC_03 COM LM13700/NS  ; pins Ibias Dio_bias in+ in- out V- buf_in buf_out V+
I5 COM N019 1µ
R6 NC_04 VREF 300
R8 BUF1 0 20K
R9 BUF2 0 20k
R10 N007 VREF 100
R11 N014 VREF 100
R12 N006 N008 100
R13 N006 N009 100
R19 BUF1 N021 10k
R16 N022 VREF 30
R17 BUF2 N012 100
R18 BUF2 N022 10k
R20 N006 N010 100
R21 N021 VREF 200
XU3 N011 N020 N015 N022 PT2 0 NC_05 NC_06 COM LM13700/NS  ; pins Ibias Dio_bias in+ in- out V- buf_in buf_out V+
I2 COM N020 1µ
R5 N015 VREF 100
R14 N006 N011 100
R22 N013 VREF 300
XU4 N025 N030 N027 N032 PT1 0 PT1 BUF1 COM LM13700/NS  ; pins Ibias Dio_bias in+ in- out V- buf_in buf_out V+
I4 COM N023 PWL(0µ 300u 1m 300u 8m 900u)
I6 COM N030 1µ
C3 0 PT1 1n
XU5 N026 N031 N028 BUF1 PT2 0 PT2 BUF2 COM LM13700/NS  ; pins Ibias Dio_bias in+ in- out V- buf_in buf_out V+
I7 COM N031 1µ
C4 0 PT2 100p
R23 DRV N029 100
R24 N029 VREF 20
R25 NC_07 VREF 300
R26 BUF1 0 20K
R27 BUF2 0 20k
R28 N024 VREF 100
R29 N023 N025 100
R30 N023 N026 100
R31 BUF1 N032 10k
R32 N033 VREF 30
R33 BUF2 N027 100
R34 BUF2 N033 10k
R36 N032 VREF 200
R37 N028 VREF 300
XU6 N037 N042 AMP11 N045 PT11 0 NC_08 NC_09 COM LM13700/NS  ; pins Ibias Dio_bias in+ in- out V- buf_in buf_out V+
I9 COM N042 1µ
C5 0 PT11 100p
R38 DRV FLTIN 100
R39 FLTIN VREF 20
R40 NC_10 0 4.7k
R42 N034 N037 100
R43 BUF11 N045 2k
I10 COM N034 PWL(0u 100u 1m 100u 8m 1000u)
XU7 N038 N043 N040 N046 PT22 0 NC_11 NC_12 COM LM13700/NS  ; pins Ibias Dio_bias in+ in- out V- buf_in buf_out V+
I11 COM N043 1µ
C6 0 PT22 100p
R41 NC_13 0 4.7k
R44 N034 N038 100
R45 BUF22 N045 2k
R46 N045 VREF 100
R47 BUF11 N040 2.4k
R48 N040 VREF 220
R49 N046 VREF 100
XU8 N036 N041 N039 N044 AMP11 0 NC_14 NC_15 COM LM13700/NS  ; pins Ibias Dio_bias in+ in- out V- buf_in buf_out V+
I13 COM NC_16 1µ
R51 N035 N036 100
I14 COM N035 100µ
R54 BUF11 N039 1k
R55 N039 VREF 330
R56 NC_17 VREF 1k
R57 AMP11 N044 200
R50 BUF22 N046 1.8k
XU9 PT11 BUF11 COM 0 BUF11 MCP6021  ; pins In+ In- V+ V- OUT
XU10 PT22 BUF22 COM 0 BUF22 MCP6021  ; pins In+ In- V+ V- OUT
R58 N044 VREF 10
.model NPN NPN
.model PNP PNP
.lib standard.bjt
.tran 0 8m 100u 10n
* Theremin Current Sensing Oscillator with PLL.
* Variable Frequency
* Bandpass Filter.
* Has zero phase shift
* on middle frequency.
.ic V(PT1)=3.41
.ic V(PT2)=3.46
.ic V(PT1)=3.41
.ic V(PT2)=3.46
.ic V(PT11)=3.4
.ic V(PT22)=3.5
.lib ns_models.lib
.lib MCP6021.cir
.backanno
.end